# Altium schematic sheet TELM0002ADC.SchDoc: MAX127 Telemetry Circuit
size A3; Engineer: A. SHAW; Organization: BLUEsat Project; Address1: Room 419; Address2: School of EE&T; Address3: UNSW, NSW 2052; Address4: Australia; DocumentNumber: TELM0002; SheetNumber: 1; SheetTotal: 1; Description: Telemetry ADC Circuit; Version: 1.0
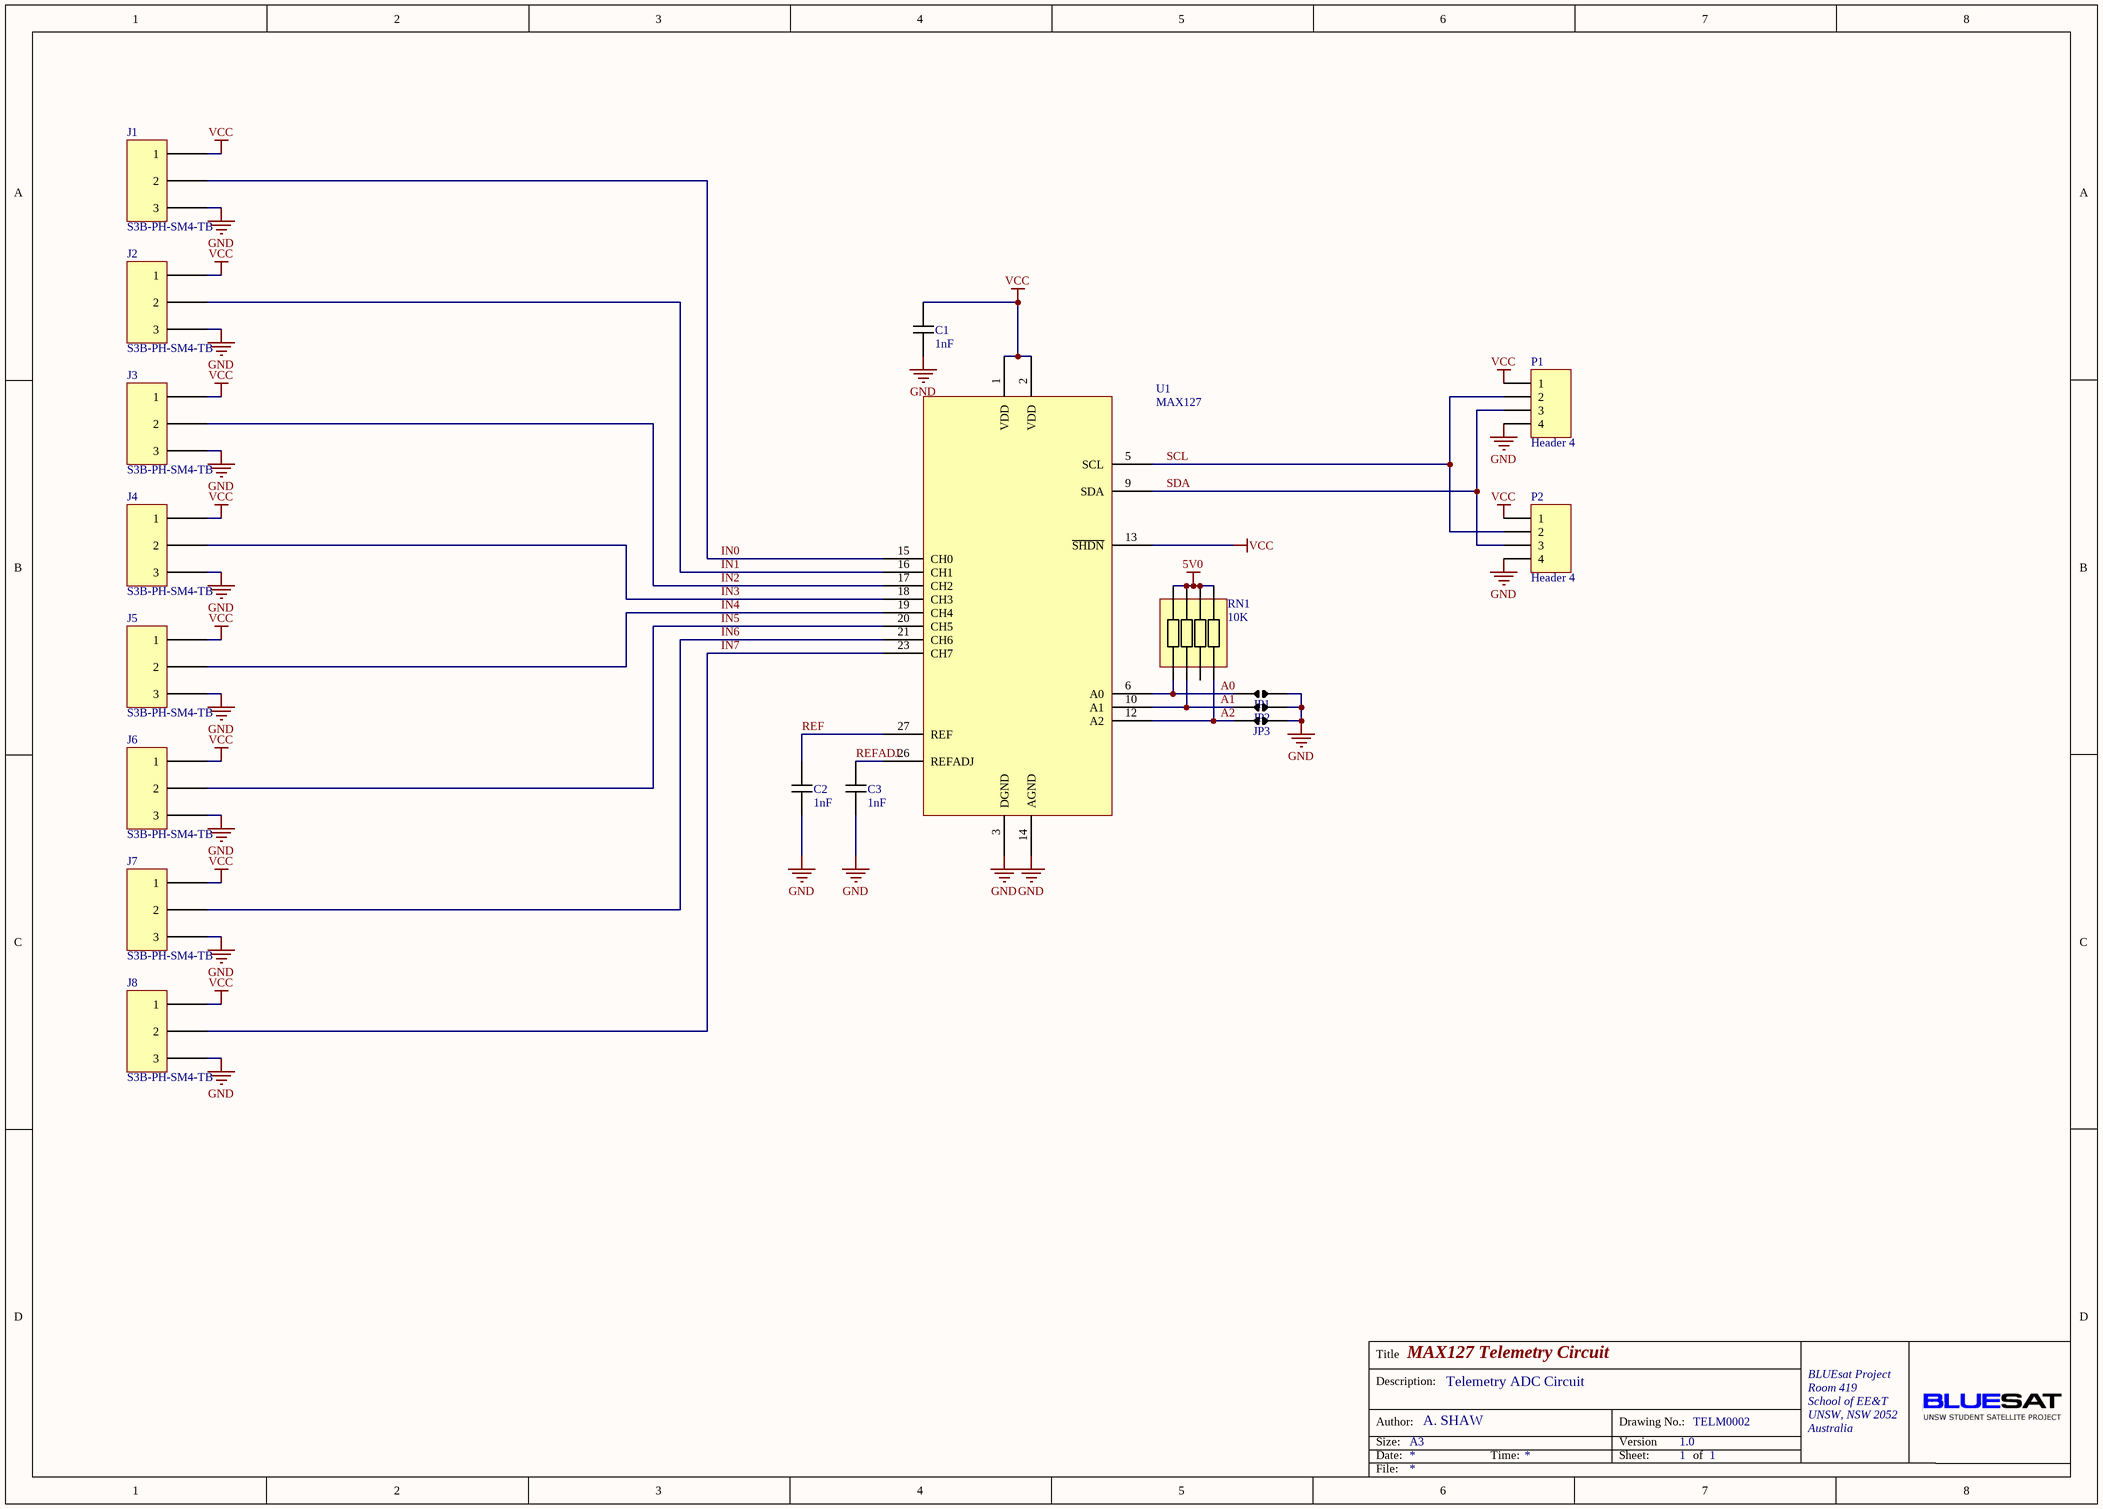
[diagram p0: TELM0002ADC.SchDoc]

## Parts
C1  value 1nF  [1206 Cap]  (hidden comment: 1206 Cap)
C2  value 1nF  [1206 Cap]  (hidden comment: 1206 Cap)
C3  value 1nF  [1206 Cap]  (hidden comment: 1206 Cap)
J1  S3B-PH-SM4-TB  [S3B-PH-SM4-TB]
J2  S3B-PH-SM4-TB  [S3B-PH-SM4-TB]
J3  S3B-PH-SM4-TB  [S3B-PH-SM4-TB]
J4  S3B-PH-SM4-TB  [S3B-PH-SM4-TB]
J5  S3B-PH-SM4-TB  [S3B-PH-SM4-TB]
J6  S3B-PH-SM4-TB  [S3B-PH-SM4-TB]
J7  S3B-PH-SM4-TB  [S3B-PH-SM4-TB]
J8  S3B-PH-SM4-TB  [S3B-PH-SM4-TB]
JP1  Jumper  [Solder Jumper C]  (value not drawn)
JP2  Jumper  [Solder Jumper C]  (value not drawn)
JP3  Jumper  [Solder Jumper C]  (value not drawn)
P1  Header 4  [HDR1X4]
P2  Header 4  [HDR1X4]
RN1  value 10K  [ACAS_0612_AC]  (hidden comment: RN4)
U1  MAX127  [SSOP28 - MAX127]

## Nets
5V0: RN1.5 RN1.6 RN1.7 RN1.8
GND: C1.1 C2.1 C3.1 J1.3 J2.3 J3.3 J4.3 J5.3 J6.3 J7.3 J8.3 JP1.2 JP2.2 JP3.2 P1.4 P2.4 U1.3(DGND) U1.14(AGND)
VCC: C1.2 J1.1 J2.1 J3.1 J4.1 J5.1 J6.1 J7.1 J8.1 P1.1 P2.1 U1.1(VDD) U1.2(VDD) U1.13(~{SHDN})
A0: JP1.1 RN1.1 U1.6(A0)
A1: JP2.1 RN1.2 U1.10(A1)
A2: JP3.1 RN1.4 U1.12(A2)
IN0: J1.2 U1.15(CH0)
IN1: J2.2 U1.16(CH1)
IN2: J3.2 U1.17(CH2)
IN3: J4.2 U1.18(CH3)
IN4: J5.2 U1.19(CH4)
IN5: J6.2 U1.20(CH5)
IN6: J7.2 U1.21(CH6)
IN7: J8.2 U1.23(CH7)
REF: C2.2 U1.27(REF)
REFADJ: C3.2 U1.26(REFADJ)
SCL: P1.2 P2.2 U1.5(SCL)
SDA: P1.3 P2.3 U1.9(SDA)

Not connected (* = marked no-connect by the designer): RN1 3

## Notes on the sheet
- Title
- Description:
- Size:
- Author:
- Date:
- A3
- Time:
- Version
- Sheet:
- Drawing No.:
- of
- File:

## Library data of the parts
C1-C3 = 1206 MLCC - X7R, 10%
J1-J8 = S3B-PH-SM4-TB: JST connector
JP1-JP3 = Solder Bridge
P1 P2 = Header 4: Header, 4-Pin; LatestRevisionDate: 17-Jul-2002; LatestRevisionNote: Re-released for DXP Platform.; Publisher: Altium Limited
U1 = MAX127: 8 Channel, 12 bit, I2C DAS